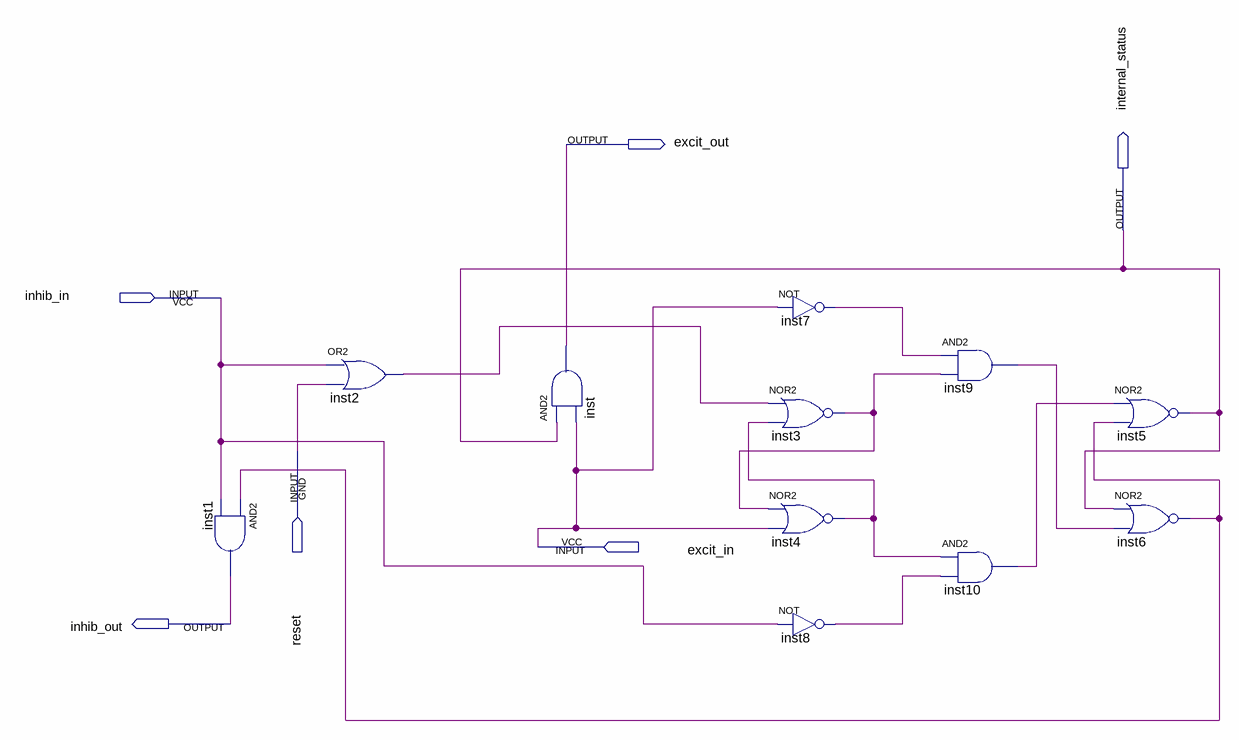
[diagram p0: schematic sheet]
// Quartus schematic subneural_node.bdf as structural Verilog: 11 symbols, 6 pins
module subneural_node (
  input  inhib_in,
  input  reset,
  input  excit_in,
  output excit_out,
  output internal_status,
  output inhib_out
);

  wire inst2_out, inst3_out, inst4_out, inst6_out, inst7_out, inst8_out, inst9_out, inst10_out;

  and inst1 (inhib_out, inst6_out, inhib_in);
  or inst2 (inst2_out, inhib_in, reset);
  and inst (excit_out, internal_status, excit_in);
  not inst7 (inst7_out, excit_in);
  nor inst3 (inst3_out, inst2_out, inst4_out);
  nor inst4 (inst4_out, inst3_out, excit_in);
  not inst8 (inst8_out, inhib_in);
  and inst9 (inst9_out, inst7_out, inst3_out);
  and inst10 (inst10_out, inst4_out, inst8_out);
  nor inst5 (internal_status, inst10_out, inst6_out);
  nor inst6 (inst6_out, internal_status, inst9_out);
endmodule
